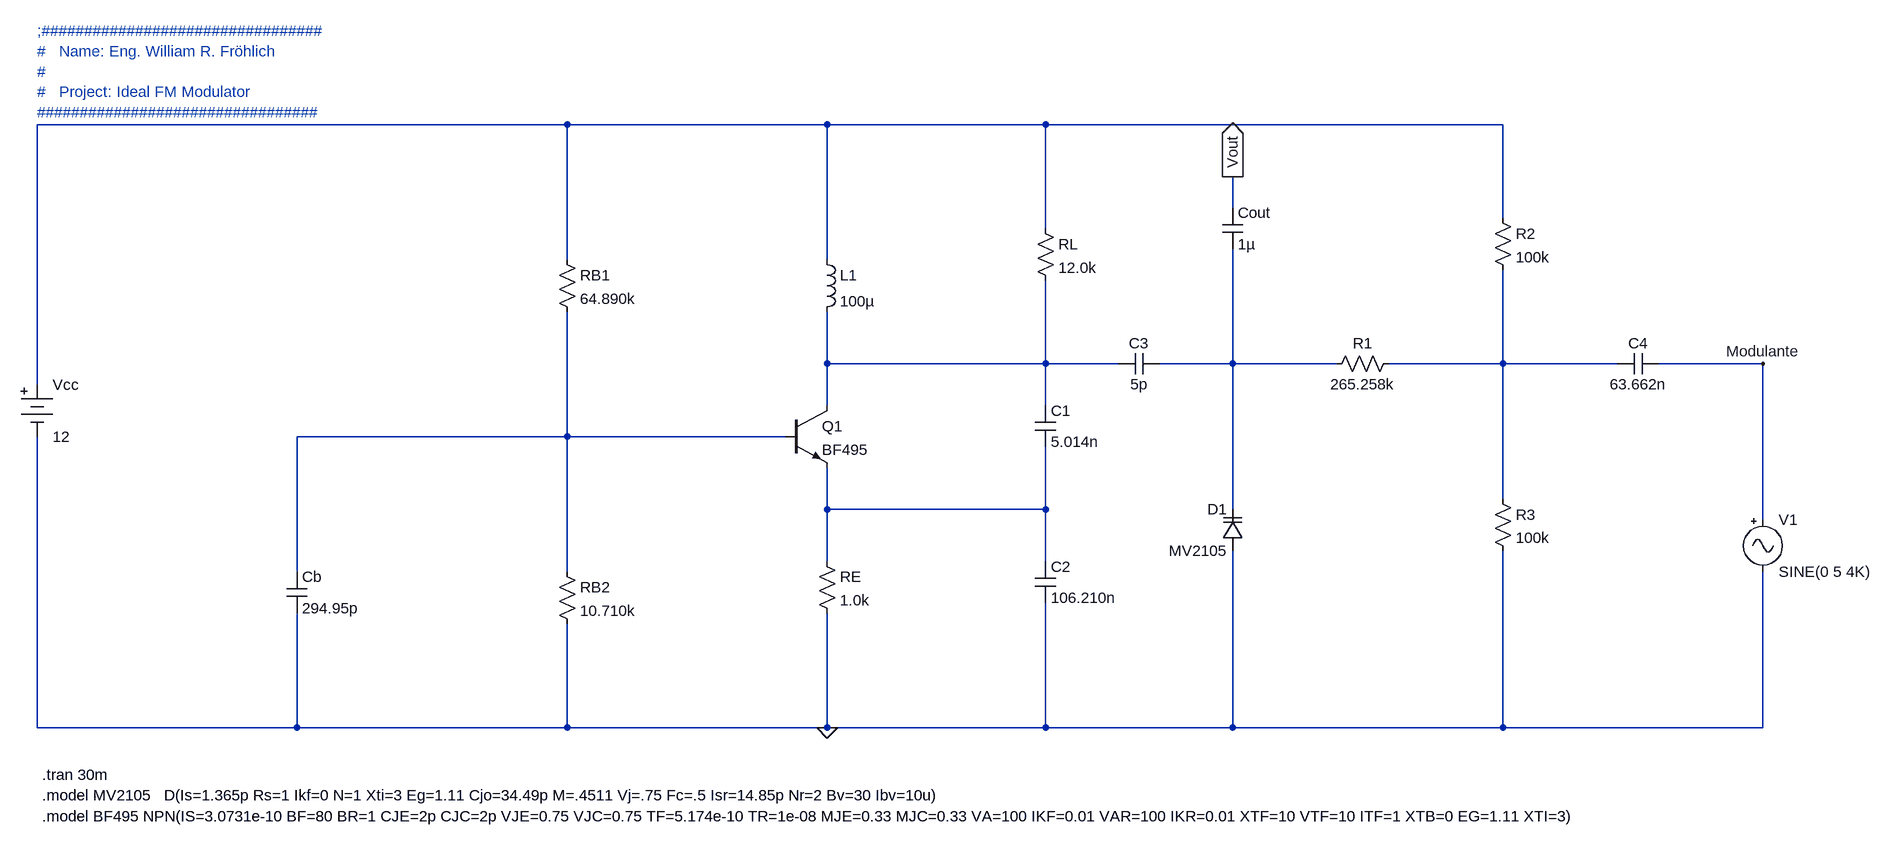
[diagram p0: schematic FM_Modulator_Ideal.asc]
FM_Modulator_Ideal.asc, the LTspice schematic file:
Version 4
SHEET 1 1376 680
WIRE -640 -656 -1456 -656
WIRE -240 -656 -640 -656
WIRE 96 -656 -240 -656
WIRE 800 -656 96 -656
WIRE 384 -528 384 -576
WIRE 800 -512 800 -656
WIRE 96 -496 96 -656
WIRE -640 -448 -640 -656
WIRE -240 -448 -240 -656
WIRE -240 -288 -240 -368
WIRE 96 -288 96 -416
WIRE 96 -288 -240 -288
WIRE 208 -288 96 -288
WIRE 384 -288 384 -464
WIRE 384 -288 272 -288
WIRE 544 -288 384 -288
WIRE 800 -288 800 -432
WIRE 800 -288 624 -288
WIRE 976 -288 800 -288
WIRE 1200 -288 1040 -288
WIRE -1456 -256 -1456 -656
WIRE -240 -224 -240 -288
WIRE 96 -224 96 -288
WIRE -640 -176 -640 -368
WIRE -640 -176 -1056 -176
WIRE -304 -176 -640 -176
WIRE 800 -80 800 -288
WIRE -240 -64 -240 -128
WIRE 96 -64 96 -160
WIRE 96 -64 -240 -64
WIRE 384 -64 384 -288
WIRE 1200 -48 1200 -288
WIRE -240 16 -240 -64
WIRE 96 16 96 -64
WIRE -1056 32 -1056 -176
WIRE -640 32 -640 -176
WIRE -1456 272 -1456 -176
WIRE -1056 272 -1056 96
WIRE -1056 272 -1456 272
WIRE -640 272 -640 112
WIRE -640 272 -1056 272
WIRE -240 272 -240 96
WIRE -240 272 -640 272
WIRE 96 272 96 80
WIRE 96 272 -240 272
WIRE 384 272 384 0
WIRE 384 272 96 272
WIRE 800 272 800 0
WIRE 800 272 384 272
WIRE 1200 272 1200 32
WIRE 1200 272 800 272
FLAG -240 272 0
FLAG 384 -576 Vout
IOPIN 384 -576 Out
FLAG 1200 -288 Modulante
SYMBOL npn -304 -224 R0
SYMATTR InstName Q1
SYMATTR Value BF495
SYMBOL ind -256 -464 R0
SYMATTR InstName L1
SYMATTR Value 100µ
SYMBOL res -256 0 R0
SYMATTR InstName RE
SYMATTR Value 1.0k
SYMBOL res -656 16 R0
SYMATTR InstName RB2
SYMATTR Value 10.710k
SYMBOL res -656 -464 R0
SYMATTR InstName RB1
SYMATTR Value 64.890k
SYMBOL cap -1072 32 R0
SYMATTR InstName Cb
SYMATTR Value 294.95p
SYMBOL cap 80 -224 R0
SYMATTR InstName C1
SYMATTR Value 5.014n
SYMBOL cap 80 16 R0
SYMATTR InstName C2
SYMATTR Value 106.210n
SYMBOL res 80 -512 R0
SYMATTR InstName RL
SYMATTR Value 12.0k
SYMBOL varactor 400 0 R180
WINDOW 0 24 64 Left 2
WINDOW 3 24 0 Left 2
SYMATTR InstName D1
SYMATTR Value MV2105
SYMBOL cap 368 -528 R0
SYMATTR InstName Cout
SYMATTR Value 1µ
SYMBOL res 784 -528 R0
SYMATTR InstName R2
SYMATTR Value 100k
SYMBOL res 784 -96 R0
SYMATTR InstName R3
SYMATTR Value 100k
SYMBOL res 640 -304 R90
WINDOW 0 0 56 VBottom 2
WINDOW 3 32 56 VTop 2
SYMATTR InstName R1
SYMATTR Value 265.258k
SYMBOL cap 272 -304 R90
WINDOW 0 0 32 VBottom 2
WINDOW 3 32 32 VTop 2
SYMATTR InstName C3
SYMATTR Value 5p
SYMBOL cap 1040 -304 R90
WINDOW 0 0 32 VBottom 2
WINDOW 3 32 32 VTop 2
SYMATTR InstName C4
SYMATTR Value 63.662n
SYMBOL Misc\\signal 1200 -64 R0
SYMATTR InstName V1
SYMATTR Value SINE(0 5 4K)
SYMBOL Misc\\battery -1456 -272 R0
SYMATTR InstName Vcc
SYMATTR Value 12
TEXT -1448 408 Left 2 !.model BF495 NPN(IS=3.0731e-10 BF=80 BR=1 CJE=2p CJC=2p VJE=0.75 VJC=0.75 TF=5.174e-10 TR=1e-08 MJE=0.33 MJC=0.33 VA=100 IKF=0.01 VAR=100 IKR=0.01 XTF=10 VTF=10 ITF=1 XTB=0 EG=1.11 XTI=3)
TEXT -1448 376 Left 2 !.model MV2105   D(Is=1.365p Rs=1 Ikf=0 N=1 Xti=3 Eg=1.11 Cjo=34.49p M=.4511 Vj=.75 Fc=.5 Isr=14.85p Nr=2 Bv=30 Ibv=10u)
TEXT -1448 344 Left 2 !.tran 30m
TEXT -1456 -800 Left 2 ;;#################################\n#   Name: Eng. William R. Fröhlich\n#\n#   Project: Ideal FM Modulator\n#################################

The netlist it stands for:
* FM_Modulator_Ideal.asc
Q1 N002 N005 N006 0 BF495
L1 N001 N002 100µ
RE N006 0 1.0k
RB2 N005 0 10.710k
RB1 N001 N005 64.890k
Cb N005 0 294.95p
C1 N002 N006 5.014n
C2 N006 0 106.210n
RL N001 N002 12.0k
D1 0 N003 MV2105
Cout Vout N003 1µ
R2 N001 N004 100k
R3 N004 0 100k
R1 N004 N003 265.258k
C3 N003 N002 5p
C4 Modulante N004 63.662n
V1 Modulante 0 SINE(0 5 4K)
Vcc N001 0 12
.model D D
.lib standard.dio
.model NPN NPN
.model PNP PNP
.lib standard.bjt
.model BF495 NPN(IS=3.0731e-10 BF=80 BR=1 CJE=2p CJC=2p VJE=0.75 VJC=0.75 TF=5.174e-10 TR=1e-08 MJE=0.33 MJC=0.33 VA=100 IKF=0.01 VAR=100 IKR=0.01 XTF=10 VTF=10 ITF=1 XTB=0 EG=1.11 XTI=3)
.model MV2105   D(Is=1.365p Rs=1 Ikf=0 N=1 Xti=3 Eg=1.11 Cjo=34.49p M=.4511 Vj=.75 Fc=.5 Isr=14.85p Nr=2 Bv=30 Ibv=10u)
.tran 30m
* ;#################################
* #   Name: Eng. William R. Fröhlich
* #
* #   Project: Ideal FM Modulator
* #################################
.backanno
.end